# EAGLE design timer (EAGLE 9.1.3)
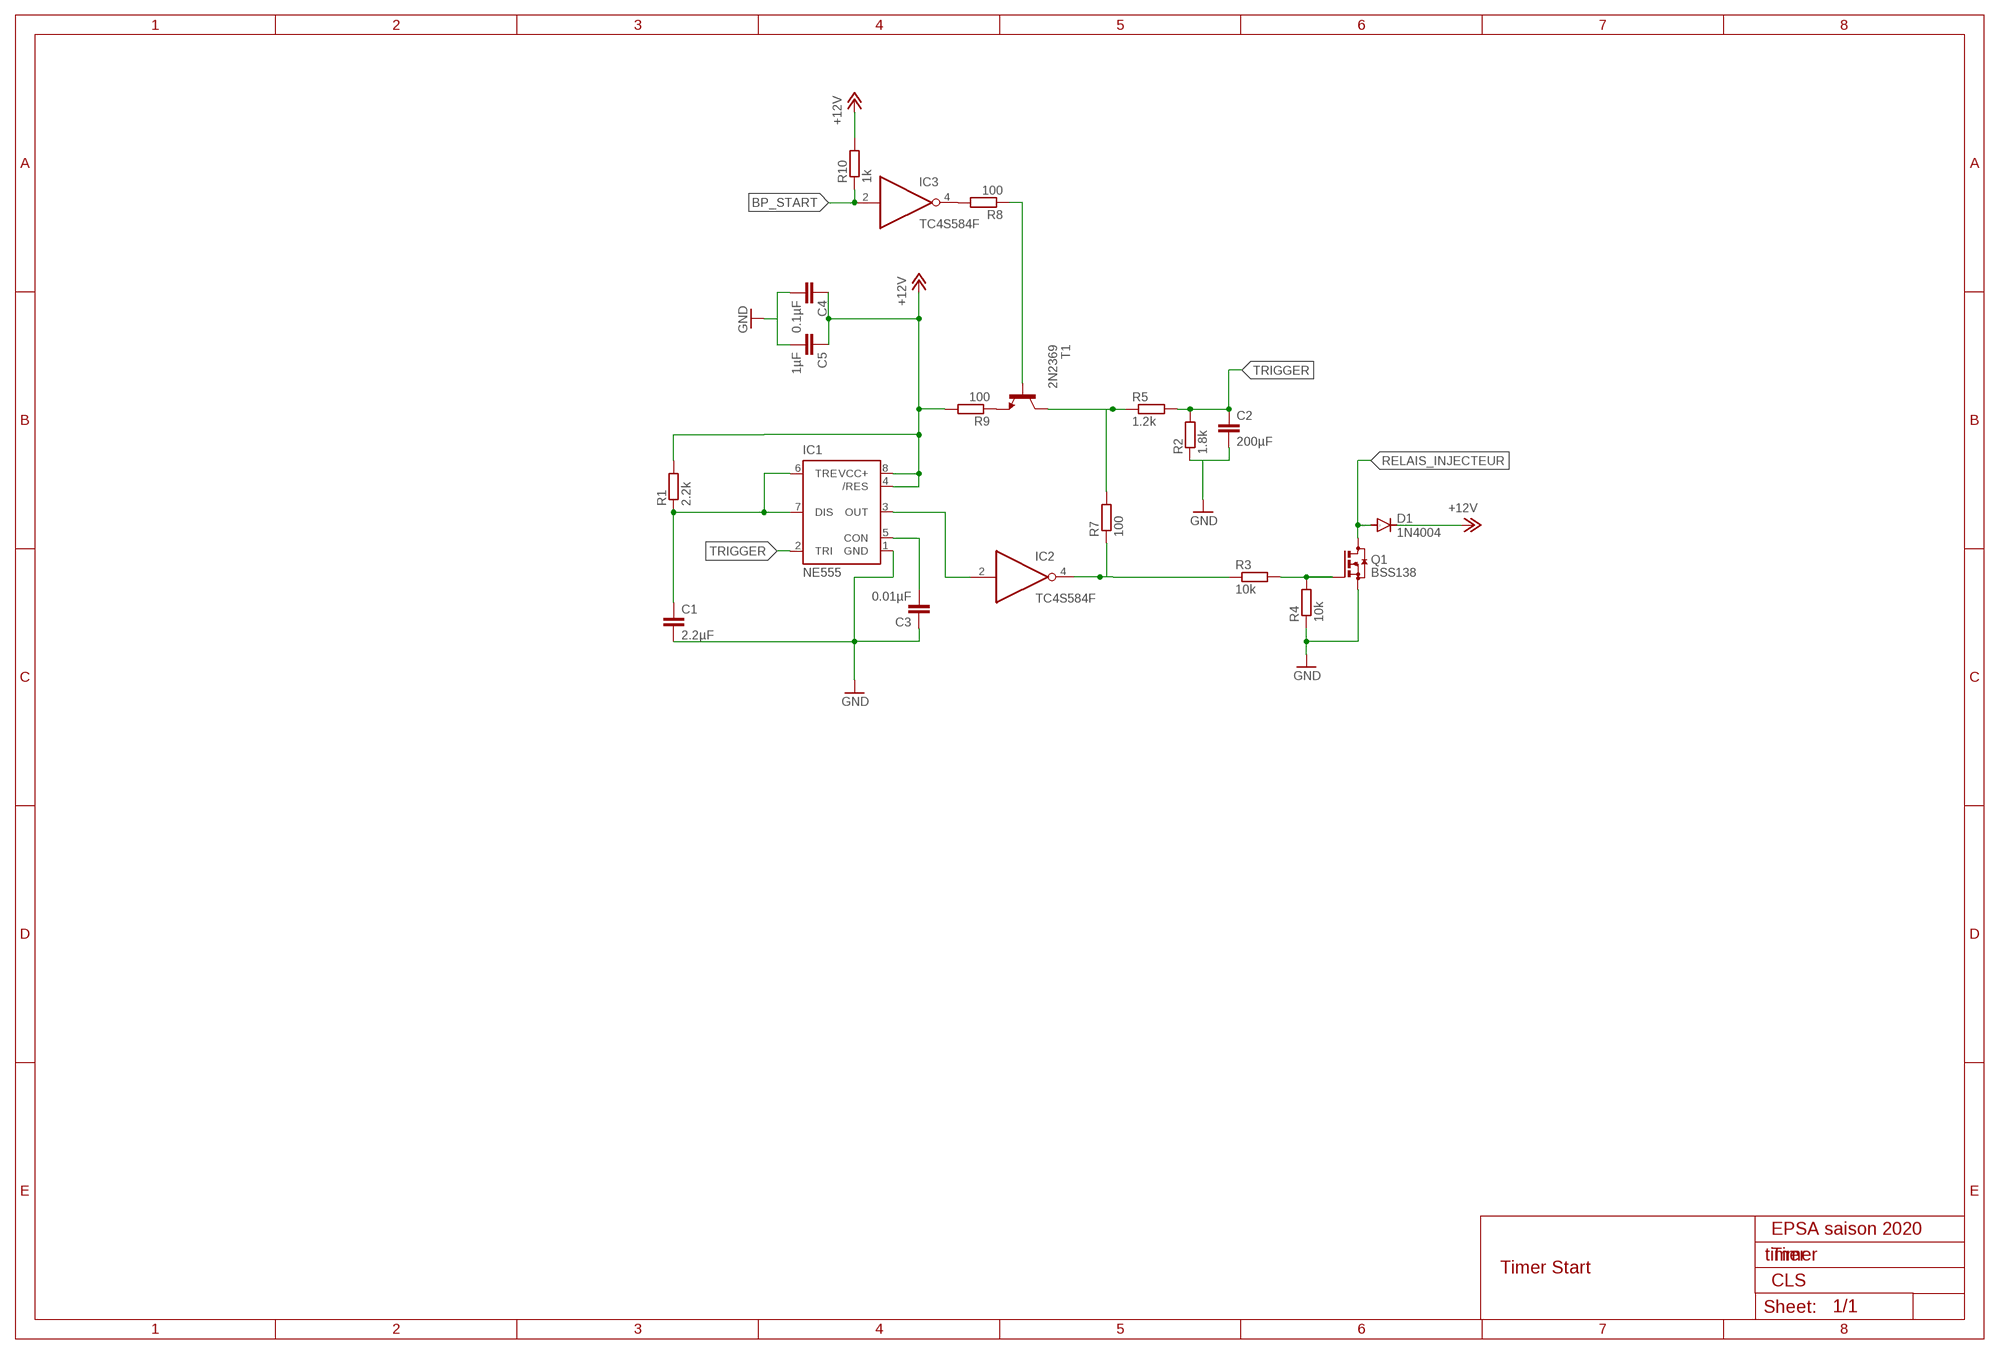
[diagram p0: schematic, sheet 1]

## Parts
C1  2.2µF  C-EUC0805  [C0805]
C2  200µF  C-EUC0805  [C0805]
C3  0.01µF  C-EUC0805  [C0805]
C4  0.1µF  C-EUC0805  [C0805]
C5  1µF  C-EUC0805  [C0805]
D1  1N4004  [DO41-10]
IC1  NE555  [DIL-08]
IC2  TC4S584F  74AHC1G04DBV  [SOT23-5]
IC3  TC4S584F  74AHC1G04DBV  [SOT23-5]
Q1  BSS138  BSS123  [SOT23]
R1  2.2k  R-EU_R0805  [R0805]
R2  1.8k  R-EU_R0805  [R0805]
R3  10k  R-EU_R0805  [R0805]
R4  10k  R-EU_R0805  [R0805]
R5  1.2k  R-EU_R0805  [R0805]
R7  100  R-EU_R0805  [R0805]
R8  100  R-EU_R0805  [R0805]
R9  100  R-EU_R0805  [R0805]
R10  1k  R-EU_R0805  [R0805]
T1  2N2369  [TO18]

## Nets
+12V: C4.1 C5.1 D1.C IC1.4(/RES) IC1.8(VCC+) R1.2 R9.2 R10.2
BP_START: IC3.2(I) R10.1
GND: C1.2 C3.1 IC1.1(GND) Q1.2(S) R4.1
N$1: C3.2 IC1.5(CON)
N$2: C1.1 IC1.6(TRE) IC1.7(DIS) R1.1
N$3: C4.2 C5.2
N$4: C2.2 R2.1
N$5: R5.1 R7.2 T1.3(C)
N$6: IC2.4(O) R3.1 R7.1
N$7: Q1.1(G) R3.2 R4.2
N$8: IC1.3(OUT) IC2.2(I)
N$9: IC3.4(O) R8.2
N$10: R9.1 T1.1(E)
N$11: R8.1 T1.2(B)
RELAIS_INJECTEUR: D1.A Q1.3(D)
TRIGGER: C2.1 IC1.2(TRI) R2.2 R5.2

## Notes on the sheet
- EPSA saison 2020
- Timer
- Timer Start
- CLS

## Power pins joined to a net without a drawn wire
GND: IC2.3(GND) IC3.3(GND)
VCC: IC2.5(VCC) IC3.5(VCC)

## Library data of the parts
C1-C5 = rcl:C-EU: CAPACITOR, European symbol; SPICEPREFIX: C
D1 = diode:1N4004: DIODE general purpose rectifier, 1 A
IC1 = st-microelectronics:NE555: General purpose bipolar Timer; MF: Arrow Electronics; MPN: NE555N; OC_FARNELL: 1467742; OC_NEWARK: 89K1486
IC2 IC3 = 74xx-little-us:74*1G04: INVERTER Gate
Q1 = transistor-small-signal:BSS123: N-CHANNEL MOS FET
R1-R5 R7-R10 = rcl:R-EU_: RESISTOR, European symbol; SPICEPREFIX: R
T1 = transistor:2N2369: NPN TRANSISTOR

## Net classes
0 default: width 0.61 mm

## Board
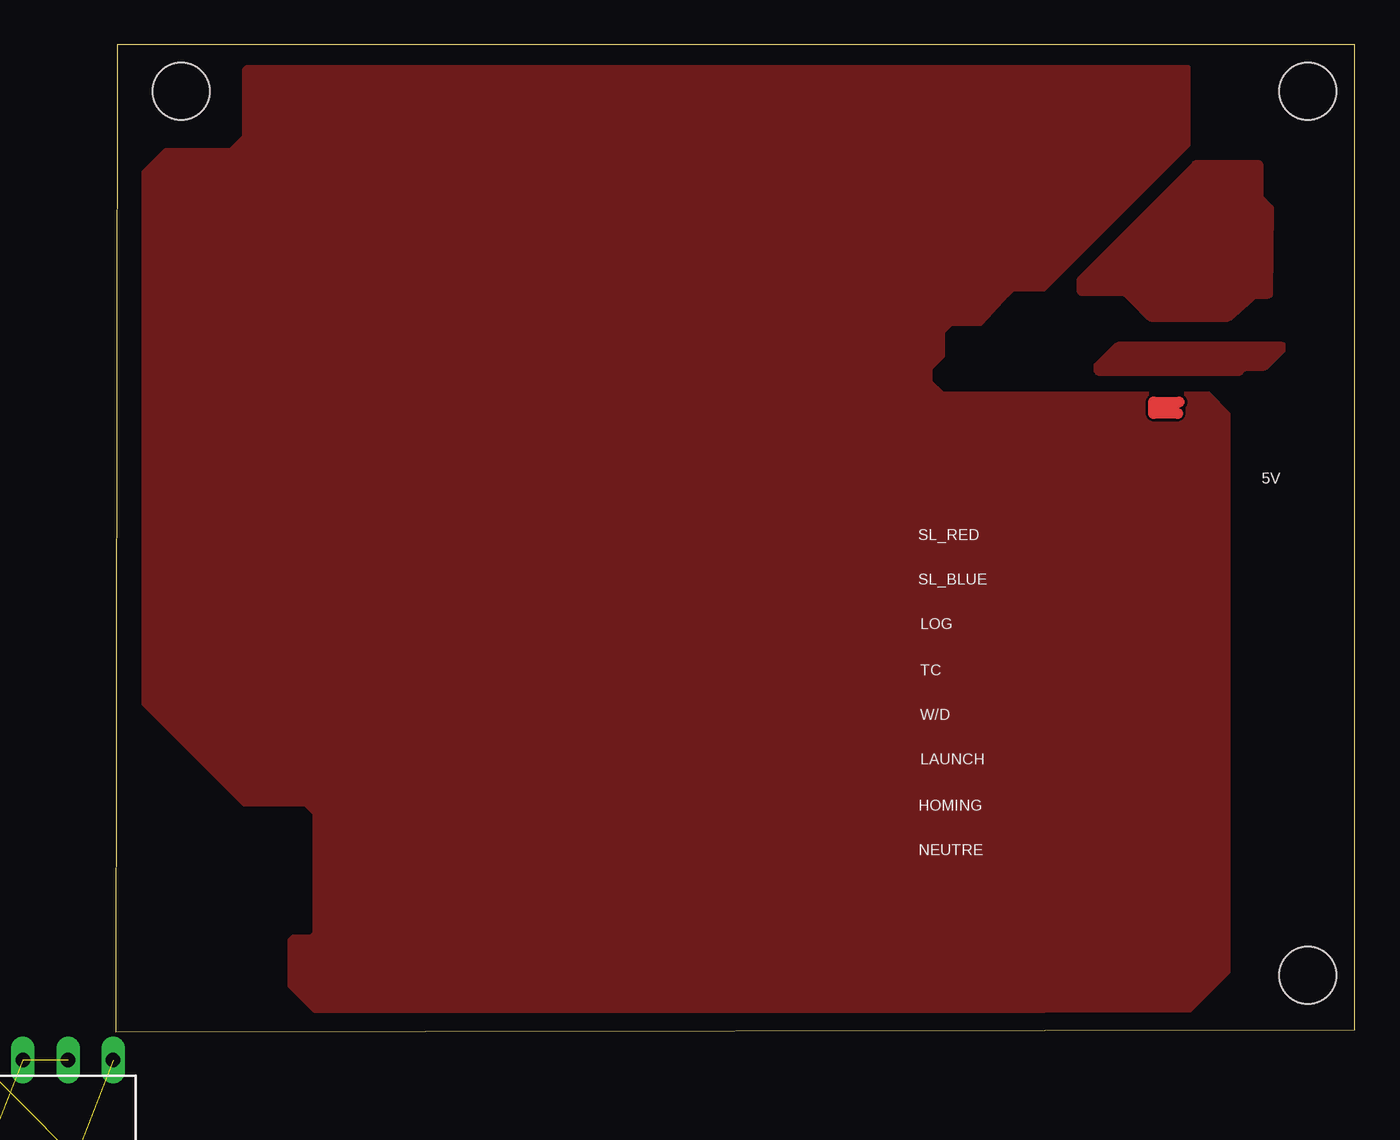
[diagram p1: board, top side]
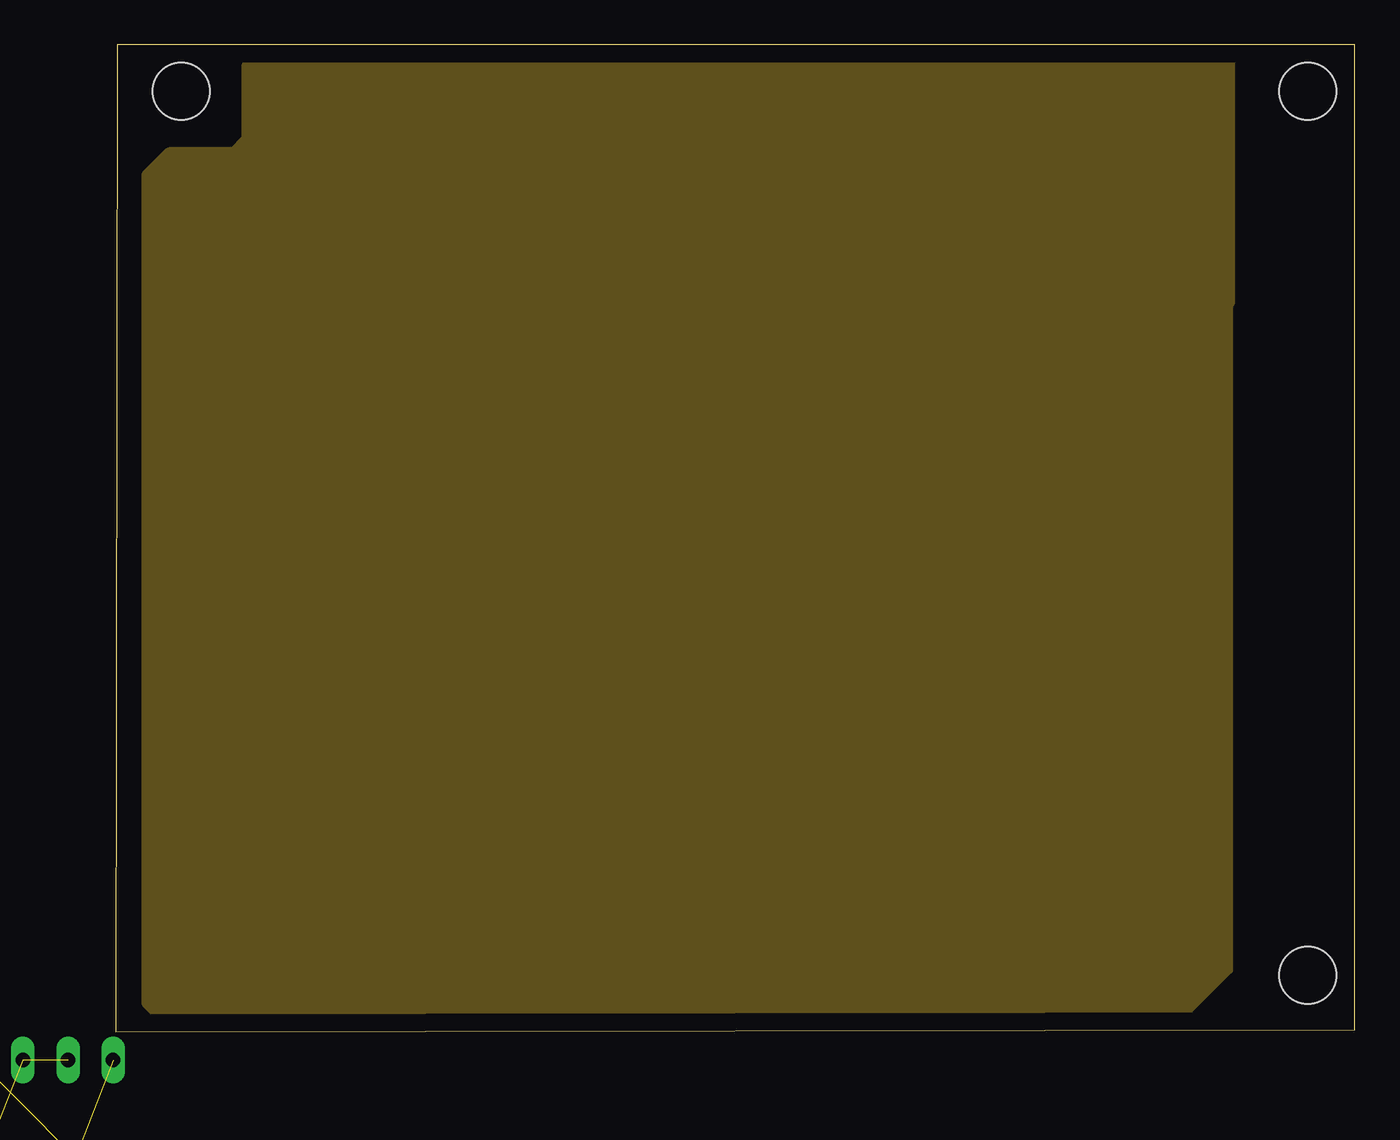
[diagram p2: board, inner layer Route2]
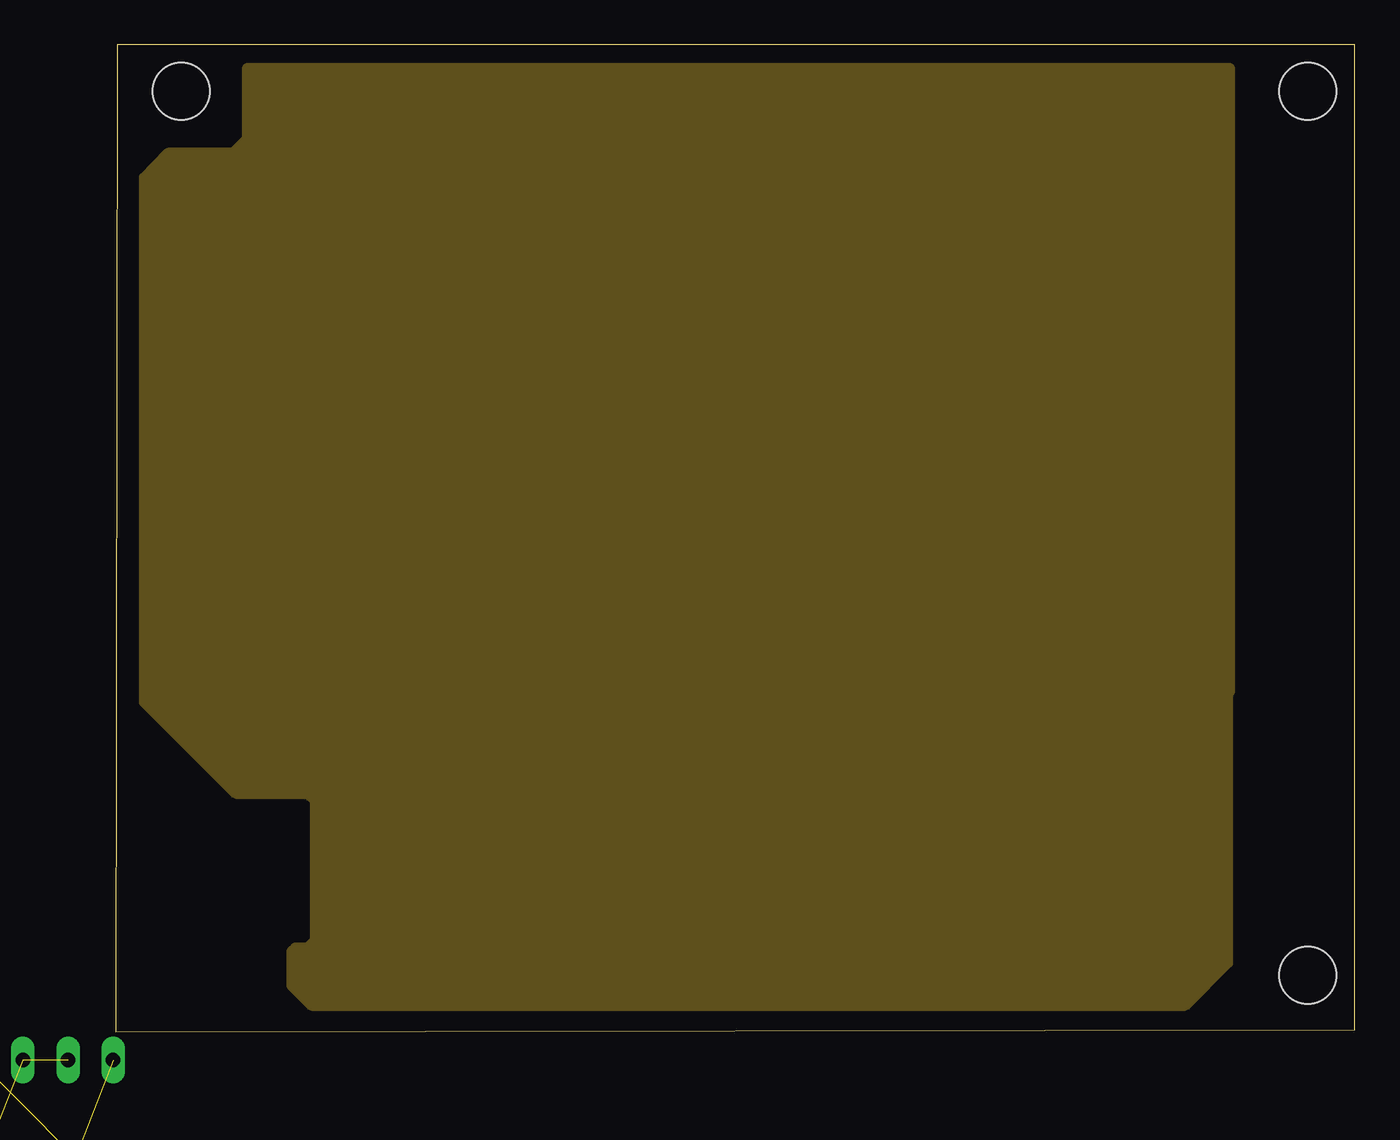
[diagram p3: board, inner layer Route15]

Size 69.65 x 55.46 mm. Coordinates in mm from the lower left corner, seen from the top.
Outline: 0,0 69.63,0.12 69.65,55.46 0.1,55.46 0,0
Copper layers (1+2*15+16): Top 0.035mm / dielectric 1.5mm / Route2 0.035mm / dielectric 0.15mm / Route15 0.035mm / dielectric 0.2mm / Bottom 0.035mm
Design rules "default *": minimum track width 6mil, minimum drill 0.35mm, track to track 6mil, track to pad 6mil, pad to pad 6mil, via to via 6mil, smd to smd 6mil, copper to edge 40mil, drill to drill 12mil, minimum pad ring 10mil, minimum via ring 8mil, stop-mask expansion 4mil, vias tented up to drill 0mil, thermal gap 10mil
Holes 3.2 mm at 66.99,52.83 66.99,3.17 3.67,52.83

### Footprints (pad centres in the part's own frame; a part is rotated, then mirrored left to right if it is on the bottom)
C0805 = smd 1.3 x 1.5: 1 -0.95,0; 2 0.95,0
DO41-10 = drill 1.118: A 5.08,0; C -5.08,0
DIL-08 = drill 0.813 long: 1 -3.81,-3.81; 2 -1.27,-3.81; 3 1.27,-3.81; 4 3.81,-3.81; 5 3.81,3.81; 6 1.27,3.81; 7 -1.27,3.81; 8 -3.81,3.81
SOT23-5 = smd 0.69 x 0.99: 1 -0.95,-1.29; 2 0,-1.29; 3 0.95,-1.29; 4 0.95,1.3; 5 -0.95,1.3
SOT23 = smd 1 x 1.4: 1 -0.95,-1.1; 2 0.95,-1.1; 3 0,1.1
R0805 = smd 1.3 x 1.5: 1 -0.95,0; 2 0.95,0
TO18 = drill 0.813 octagon: 1 -1.27,-1.27; 2 1.27,-1.27; 3 1.27,1.27

### Placement (x,y rotation side)
C1  -9.1,-13.85 0 top  (outside the outline)
C2  -9.1,-18 0 top  (outside the outline)
C3  -9.1,-22.15 0 top  (outside the outline)
C4  -9.1,-57.35 0 top  (outside the outline)
C5  -9.1,-63.5 0 top  (outside the outline)
D1  -5.1,-77.5 0 top  (outside the outline)
IC1  -3.95,-5.4 0 top
IC2  -15.95,-76.45 0 top  (outside the outline)
IC3  -23.8,-76.45 0 top  (outside the outline)
Q1  -8.7,-70.3 0 top  (outside the outline)
R1  -9.1,-26.3 0 top  (outside the outline)
R2  -9.1,-30.45 0 top  (outside the outline)
R3  -9.1,-34.6 0 top  (outside the outline)
R4  -9.1,-38.75 0 top  (outside the outline)
R5  -9.1,-42.9 0 top  (outside the outline)
R7  -9.1,-51.2 0 top  (outside the outline)
R8  -24.8,-83.95 0 top  (outside the outline)
R9  -24.8,-90.1 0 top  (outside the outline)
R10  -24.8,-96.25 0 top  (outside the outline)
T1  -22.8,-102.3 0 top  (outside the outline)

### Tracks (layer width: path | path; a pad name or v marks a point on that pad's centre or on a via)
+5V
  Top 0.61: 59.77,35.38 58.34,35.38 58.34,34.74 59.67,34.74
  pour Route15: 1.6,18.55 6.75,13.4 10.8,13.4 11.2,13 11.2,5.1 10.8,4.7 10.1,4.7 9.9,4.5 9.9,2.6 11,1.5 60.1,1.5 62.5,3.9 62.5,19.1 62.6,19.1 62.6,54.1 7.4,54.1 7.4,50.15 6.6,49.35 2.95,49.35 1.6,47.95
+12V  (7 unrouted)
  pour Top: 62.49,40.2 63.95,41.5 64.76,41.5 64.81,46.19 64.2,46.8 64.2,48.65 60.75,48.65 54.3,42.2 54.3,41.65 56.75,41.65 58.2,40.2
BP_START  (1 unrouted)
GND  (6 unrouted)
  pour Top: 1.6,48.25 1.6,18.45 7.25,12.8 10.7,12.8 11.2,12.3 11.2,5.5 11,5.3 10,5.3 9.8,5.1 9.8,2.6 11.2,1.2 60.3,1.2 62.5,3.4 62.5,34.7 61.4,35.8 46.45,35.8 45.75,36.5 45.75,37.3 46.45,38 46.45,39.35 46.9,39.8 48.6,39.8 50.05,41.4 50.4,41.75 52.14,41.75 60.25,49.86 60.25,54.15 7.4,54.15 7.25,54 7.25,50.25 6.5,49.5 2.85,49.5
  pour Route2: 62.6,40.98 62.6,54.4 62.38,54.62 7.75,54.62 7.38,54.25 7.38,50.12 6.62,49.38 3,49.38 1.75,48.12 1.75,1.62 2.62,0.75 59.73,0.75 62.5,3.52 62.5,40.88 62.4,40.98
  pour Top: 55.15,37.3 55.3,37.15 63.1,37.15 63.4,37.45 64.53,37.45 65.53,38.45 56.35,38.45 55.2,37.3
N$1  (1 unrouted)
N$2  (3 unrouted)
N$3  (1 unrouted)
N$4  (1 unrouted)
N$5  (2 unrouted)
N$6  (2 unrouted)
N$7  (2 unrouted)
N$8  (1 unrouted)
N$9  (1 unrouted)
N$10  (1 unrouted)
N$11  (1 unrouted)
RELAIS_INJECTEUR  (1 unrouted)
TRIGGER  (3 unrouted)
VCC  (1 unrouted)

### Text on the board
tNames: 5V | SL_RED | SL_BLUE | LOG | TC | W/D | LAUNCH | HOMING | NEUTRE